# Altium project Class_D_Amp_Single_Board.PrjPcb
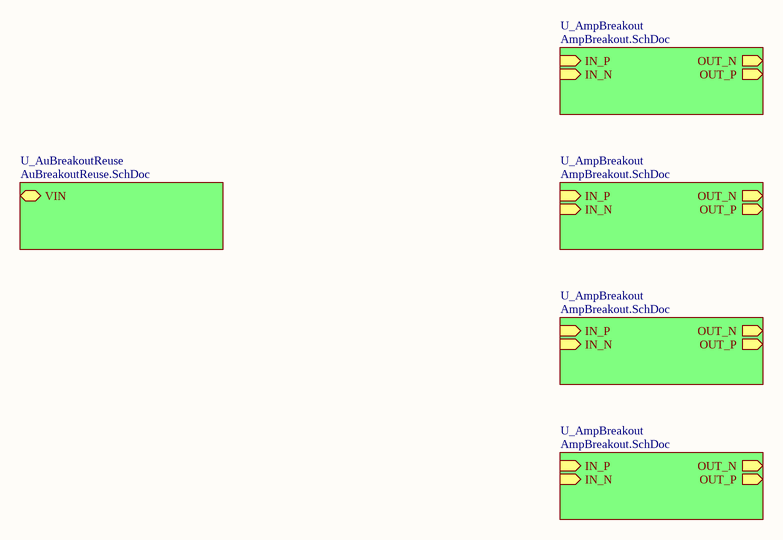
[diagram p0: TopLevelSch.SchDoc]
3 sheets, 88 parts. Net scope: hierarchical (ports join the sheet entries above them; power ports are global).
Board file: PCB1.PcbDoc
Sheets:
  TopLevelSch.SchDoc
    U_AmpBreakout = AmpBreakout.SchDoc
    U_AmpBreakout = AmpBreakout.SchDoc
    U_AmpBreakout = AmpBreakout.SchDoc
    U_AmpBreakout = AmpBreakout.SchDoc
    U_AuBreakoutReuse = AuBreakoutReuse.SchDoc

## Sheet TopLevelSch.SchDoc
size A; SheetNumber: 1; SheetTotal: 3

### Sub-sheets
U_AmpBreakout = AmpBreakout.SchDoc: OUT_N (out), OUT_P (out), IN_P (in), IN_N (in)
U_AmpBreakout = AmpBreakout.SchDoc: OUT_N (out), OUT_P (out), IN_P (in), IN_N (in)
U_AmpBreakout = AmpBreakout.SchDoc: OUT_N (out), OUT_P (out), IN_P (in), IN_N (in)
U_AmpBreakout = AmpBreakout.SchDoc: OUT_N (out), OUT_P (out), IN_P (in), IN_N (in)
U_AuBreakoutReuse = AuBreakoutReuse.SchDoc: VIN (bidir)

## Sheet AmpBreakout.SchDoc
size 431 x 279 mm; SheetNumber: 3; SheetTotal: 3
Used 4 times, as channels U_AmpBreakout, U_AmpBreakout, U_AmpBreakout, U_AmpBreakout. Parts and nets are listed once, with the designators drawn on the sheet.
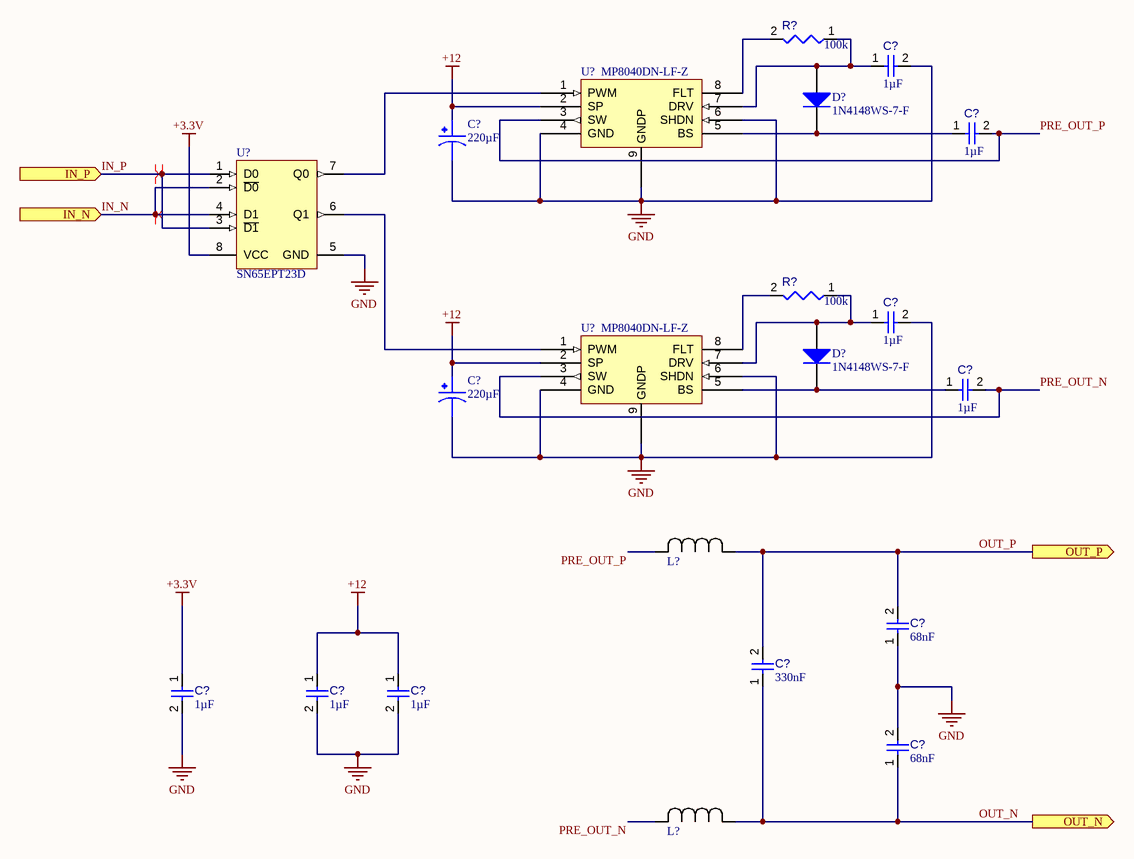
[diagram p1: AmpBreakout.SchDoc]

### Parts
(Parts that share a designator on the sheet are numbered #1, #2 ... from top to bottom, then left to right.)
C?#1  value 1µF  [CAPC2013X135X45NL10T25]  (hidden comment: Capacitor 1 uF +/- 10% 50 V 0805)
C?#2  value 1µF  [CAPC2013X135X45NL10T25]  (hidden comment: Capacitor 1 uF +/- 10% 50 V 0805)
C?#3  220µF  [CAPAE1030X1080N_UWT1H221MNL1GS]
C?#4  value 1µF  [CAPC2013X135X45NL10T25]  (hidden comment: Capacitor 1 uF +/- 10% 50 V 0805)
C?#5  value 1µF  [CAPC2013X135X45NL10T25]  (hidden comment: Capacitor 1 uF +/- 10% 50 V 0805)
C?#6  220µF  [CAPAE1030X1080N_UWT1H221MNL1GS]
C?#7  value 68nF  [FP-C0805C-DN-IPC_A]  (hidden comment: C0805C683K1RACTU)
C?#8  value 1µF  [CAPC2013X135X45NL10T25]  (hidden comment: Capacitor 1 uF +/- 10% 50 V 0805)
C?#9  value 1µF  [CAPC2013X135X45NL10T25]  (hidden comment: Capacitor 1 uF +/- 10% 50 V 0805)
C?#10  value 1µF  [CAPC2013X135X45NL10T25]  (hidden comment: Capacitor 1 uF +/- 10% 50 V 0805)
C?#11  value 330nF  [CAPC2012X14M]  (hidden comment: C2012X7R1H334K125AA)
C?#12  value 68nF  [FP-C0805C-DN-IPC_A]  (hidden comment: C0805C683K1RACTU)
D?#1  1N4148WS-7-F  [DIOD-SOD323-2-A_V]
D?#2  1N4148WS-7-F  [DIOD-SOD323-2-A_V]
L?#1  PQ2614BHA-220K  [IND_PQ2614_BRN]  (value not drawn)
L?#2  PQ2614BHA-220K  [IND_PQ2614_BRN]  (value not drawn)
R?#1  value 100k  [RESC0402(1005)_L]  (hidden comment: 100KR2F)
R?#2  value 100k  [RESC0402(1005)_L]  (hidden comment: 100KR2F)
U?#1  MP8040DN-LF-Z  [SOIC127P600X130_HS-9M]
U?#2  SN65EPT23D  [D0008A_L]
U?#3  MP8040DN-LF-Z  [SOIC127P600X130_HS-9M]

### Ports
IN_N (in), IN_P (in), OUT_N (out), OUT_P (out)

### Nets
+3.3V: C?#8.1 U?#2.8(VCC)
+12: C?#3.1 C?#6.1 C?#9.1 C?#10.1 U?#1.2(SP) U?#3.2(SP)
GND: C?#1.2 C?#3.2 C?#4.2 C?#6.2 C?#7.1 C?#8.2 C?#9.2 C?#10.2 C?#12.2 U?#1.4(GND) U?#1.6(SHDN) U?#1.9(GNDP) U?#2.5(GND) U?#3.4(GND) U?#3.6(SHDN) U?#3.9(GNDP)
IN_N: U?#2.2(~{D0}) U?#2.4(D1) ; port IN_N
IN_P: U?#2.1(D0) U?#2.3(~{D1}) ; port IN_P
OUT_N: C?#11.1 C?#12.1 L?#2.1 ; port OUT_N
OUT_P: C?#7.2 C?#11.2 L?#1.1 ; port OUT_P
PRE_OUT_N: C?#5.2 L?#2.2 U?#3.3(SW)
PRE_OUT_P: C?#2.2 L?#1.2 U?#1.3(SW)
NetC?#1_1: C?#1.1 D?#1.1(A) R?#1.1 U?#1.7(DRV)
NetC?#2_1: C?#2.1 D?#1.2(K) U?#1.5(BS)
NetC?#4_1: C?#4.1 D?#2.1(A) R?#2.1 U?#3.7(DRV)
NetC?#5_1: C?#5.1 D?#2.2(K) U?#3.5(BS)
NetR?#1_2: R?#1.2 U?#1.8(FLT)
NetR?#2_2: R?#2.2 U?#3.8(FLT)
NetU?#1_1: U?#1.1(PWM) U?#2.7(Q0)
NetU?#2_6: U?#2.6(Q1) U?#3.1(PWM)

### Channels
U_AmpBreakout: designators C?=C?_U_AmpBreakout1#11 C?=C?_U_AmpBreakout1#7 C?=C?_U_AmpBreakout1#12 C?=C?_U_AmpBreakout1#2 C?=C?_U_AmpBreakout1#1 C?=C?_U_AmpBreakout1#5 C?=C?_U_AmpBreakout1#4 C?=C?_U_AmpBreakout1#8 C?=C?_U_AmpBreakout1#9 C?=C?_U_AmpBreakout1#10 C?=C?_U_AmpBreakout1#6 C?=C?_U_AmpBreakout1#3 D?=D?_U_AmpBreakout1#1 D?=D?_U_AmpBreakout1#2 L?=L?_U_AmpBreakout1#1 L?=L?_U_AmpBreakout1#2 R?=R?_U_AmpBreakout1#1 R?=R?_U_AmpBreakout1#2 U?=U?_U_AmpBreakout1#1 U?=U?_U_AmpBreakout1#2 U?=U?_U_AmpBreakout1#3; ports IN_N=IN_N_U_AmpBreakout IN_P=IN_P_U_AmpBreakout OUT_N=OUT_N_U_AmpBreakout OUT_P=OUT_P_U_AmpBreakout
U_AmpBreakout: designators C?=C?_U_AmpBreakout2#11 C?=C?_U_AmpBreakout2#7 C?=C?_U_AmpBreakout2#12 C?=C?_U_AmpBreakout2#2 C?=C?_U_AmpBreakout2#1 C?=C?_U_AmpBreakout2#5 C?=C?_U_AmpBreakout2#4 C?=C?_U_AmpBreakout2#8 C?=C?_U_AmpBreakout2#9 C?=C?_U_AmpBreakout2#10 C?=C?_U_AmpBreakout2#6 C?=C?_U_AmpBreakout2#3 D?=D?_U_AmpBreakout2#1 D?=D?_U_AmpBreakout2#2 L?=L?_U_AmpBreakout2#1 L?=L?_U_AmpBreakout2#2 R?=R?_U_AmpBreakout2#1 R?=R?_U_AmpBreakout2#2 U?=U?_U_AmpBreakout2#1 U?=U?_U_AmpBreakout2#2 U?=U?_U_AmpBreakout2#3; ports IN_N=IN_N_U_AmpBreakout IN_P=IN_P_U_AmpBreakout OUT_N=OUT_N_U_AmpBreakout OUT_P=OUT_P_U_AmpBreakout
U_AmpBreakout: designators C?=C?_U_AmpBreakout3#11 C?=C?_U_AmpBreakout3#7 C?=C?_U_AmpBreakout3#12 C?=C?_U_AmpBreakout3#2 C?=C?_U_AmpBreakout3#1 C?=C?_U_AmpBreakout3#5 C?=C?_U_AmpBreakout3#4 C?=C?_U_AmpBreakout3#8 C?=C?_U_AmpBreakout3#9 C?=C?_U_AmpBreakout3#10 C?=C?_U_AmpBreakout3#6 C?=C?_U_AmpBreakout3#3 D?=D?_U_AmpBreakout3#1 D?=D?_U_AmpBreakout3#2 L?=L?_U_AmpBreakout3#1 L?=L?_U_AmpBreakout3#2 R?=R?_U_AmpBreakout3#1 R?=R?_U_AmpBreakout3#2 U?=U?_U_AmpBreakout3#1 U?=U?_U_AmpBreakout3#2 U?=U?_U_AmpBreakout3#3; ports IN_N=IN_N_U_AmpBreakout IN_P=IN_P_U_AmpBreakout OUT_N=OUT_N_U_AmpBreakout OUT_P=OUT_P_U_AmpBreakout
U_AmpBreakout: designators C?=C?_U_AmpBreakout4#11 C?=C?_U_AmpBreakout4#7 C?=C?_U_AmpBreakout4#12 C?=C?_U_AmpBreakout4#2 C?=C?_U_AmpBreakout4#1 C?=C?_U_AmpBreakout4#5 C?=C?_U_AmpBreakout4#4 C?=C?_U_AmpBreakout4#8 C?=C?_U_AmpBreakout4#9 C?=C?_U_AmpBreakout4#10 C?=C?_U_AmpBreakout4#6 C?=C?_U_AmpBreakout4#3 D?=D?_U_AmpBreakout4#1 D?=D?_U_AmpBreakout4#2 L?=L?_U_AmpBreakout4#1 L?=L?_U_AmpBreakout4#2 R?=R?_U_AmpBreakout4#1 R?=R?_U_AmpBreakout4#2 U?=U?_U_AmpBreakout4#1 U?=U?_U_AmpBreakout4#2 U?=U?_U_AmpBreakout4#3; ports IN_N=IN_N_U_AmpBreakout IN_P=IN_P_U_AmpBreakout OUT_N=OUT_N_U_AmpBreakout OUT_P=OUT_P_U_AmpBreakout

### Layout directives
differential pair: IN_N_U_AmpBreakout, IN_P_U_AmpBreakout

### Notes on the sheet
- DWG. NO.
- REV.
- SHT.
- THIS DOCUMENT AND THE DATA DISCLOSED HEREIN OR HEREWITH IS THE PROPERTY OF ALTIUM LIMITED AND MAY BE FREELY DISTRIBUTED IN WHOLE. NO RIGHTS ARE RESERVED OR EXPRESS OR IMPLIED WARANTEE GIVEN.
- REVISION
- DESCRIPTION
- DATE
- APPROVED
- ENG:
- APPROVALS
- PROJECT
- DSN:
- CHK:
- REFERENCE DOCUMENTS
- PROJECT REVISION:
- TITLE
- DOCUMENT REVISION:
- DESIGN ITEM:
- BOM:
- FAB DWG:
- PCB DWG:
- ASSY DWG:
- SCALE:
- SIZE
- B
- CAGE CODE
- FILE NAME
- DWG NO.
- SHEET
- OF
- REV

### Library data of the parts
C?#1 C?#2 C?#4 C?#5 C?#8-C?#10 = CMP-001-00007-6: Chip Capacitor, 1 uF, +/- 10%, 50 V, 0805 (2012 Metric); Capacitor Type: Ceramic; Voltage Rating: 50V; Min Operating Temperature: -55°C; RoHS Compliant: True; Mounting Technology: SM; Case/Package: 0805; Max Operating Temperature: 125°C; Tolerance: 10%; Pins: 2
C?#3 C?#6 = CMP-017-000000-1: 220ÂµF 50V Aluminum Electrolytic Capacitors Radial, Can - SMD 1000 Hrs @ 105Â°C; MF: Nichicon; SnapEDA_Link: https://www.snapeda.com/parts/UWT1H221MNL1GS/Nichicon/view-part/566503/?ref=snap; Package: Radial Nichicon; Source: SnapEDAsch.SchLib; Price: None; Pin Count: 2; Value: *; Availability: Unavailable; MP: UWT1H221MNL1GS; Component Type: Standard; Design Item ID: UWT1H221MNL1GS
C?#7 C?#12 = CMP-001-00086-1: Ceramic Capacitor, Multilayer, Ceramic, 100V, 10% +Tol, 10% -Tol, X7R, 15% TC, 0.068uF, Surface Mount, 0805; Min Operating Temperature: -55°C; Mounting Technology: Surface Mount; Max Operating Temperature: 125°C; RoHS Compliant: Yes; Pins: 2; Capacitor Type: Ceramic; Case/Package: 0805
C?#11 = CMP-001-00084-2: Ceramic Capacitor, Multilayer, Ceramic, 50V, 10% +Tol, 10% -Tol, X7R, 15% TC, 0.33uF, Surface Mount, 0805; Pins: 2; RoHS Compliant: Yes; Min Operating Temperature: -55°C; Capacitor Type: Ceramic; Max Operating Temperature: 125°C; Case/Package: 0805; Mounting Technology: Surface Mount
D?#1 D?#2 = CMP-004-00002-2: Fast Switching Diode, 75 V, 0.3 A, -65 to 150 degC, 2-Pin SOD323, RoHS, Tape and Reel; Manufacturer: Diodes Inc; Peak Reverse Current: 1uA; Max Surge Current: 2A; Elements: 1; Forward Current: 300mA; Recovery Time: 4ns; Forward Voltage: 1.25V; Datasheet Version: Rev. 25-2, 03/2016; Case/Package: SOD; Min Operating Temperature: -65°C; RoHS Compliant: True; Max Operating Temperature: 150°C; Manufacturer URL: http://www.diodes.com/; Pins: 2; Package Quantity: 3000; Datasheet URL: http://www.diodes.com/datasheets/ds30097.pdf; Packaging: TapeandReel; Package Description: 2-Pin Small Outline Diode, Body 1.7 x 1.3 mm; Mounting Technology: SM; Package Reference: SOD323-2
L?#1 L?#2 = CMP-006-00021-1: No Description Available; Mfr_Name: Bourns Electronics; Type: Fixed Inductors; Design Item ID: PQ2614BHA-220K; Source: PQ2614BHA-220K.SchLib
R?#1 R?#2 = CMP-009-00064-2: 100K 0.063W 1% 0402 (1005 Metric)  SMD; Power: 63mW; Case/Package: 0402; Mounting Technology: SMT; Pins: 2; Tolerance: 1%
U?#1 U?#3 = CMP-00024-00006-1: Half Bridge Based Peripheral Driver, 9A, PDSO8; Nominal Supply Voltage: 12V; Built-in Protections: Over Current,Under Voltage,THERMAL; Case/Package: HLSOP; Pins: 8; Interface IC Type: HALF BRIDGE BASED PERIPHERAL DRIVER; Max Operating Temperature: 85°C; RoHS Compliant: Yes; JESD-30 Code: R-PDSO-G8; Min Operating Temperature: -40°C; Height - Seated (Max): 1.676mm
U?#2 = CMP-016-00010-1: Low Skew Clock Driver, 65EP Series, 2 True Output(s), 0 Inverted Output(s), ECL, PDSO8; Nominal Supply Voltage: 3.3V; Min Supply Voltage: 3V; Max Supply Voltage: 3.6V; Input Conditioning: DIFFERENTIAL; RoHS Compliant: Yes; Height - Seated (Max): 1.75mm; Logic Type: LOW SKEW CLOCK DRIVER; Max Operating Temperature: 85°C; JESD-30 Code: R-PDSO-G8; Min Operating Temperature: -40°C; Case/Package: SOP; JESD-609 Code: e4; Pins: 8

## Sheet AuBreakoutReuse.SchDoc
size 863 x 558 mm; SheetNumber: 2; SheetTotal: 2
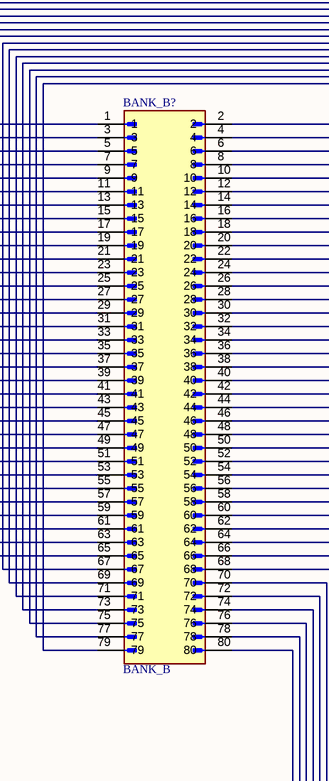
[diagram p2: AuBreakoutReuse.SchDoc, left]
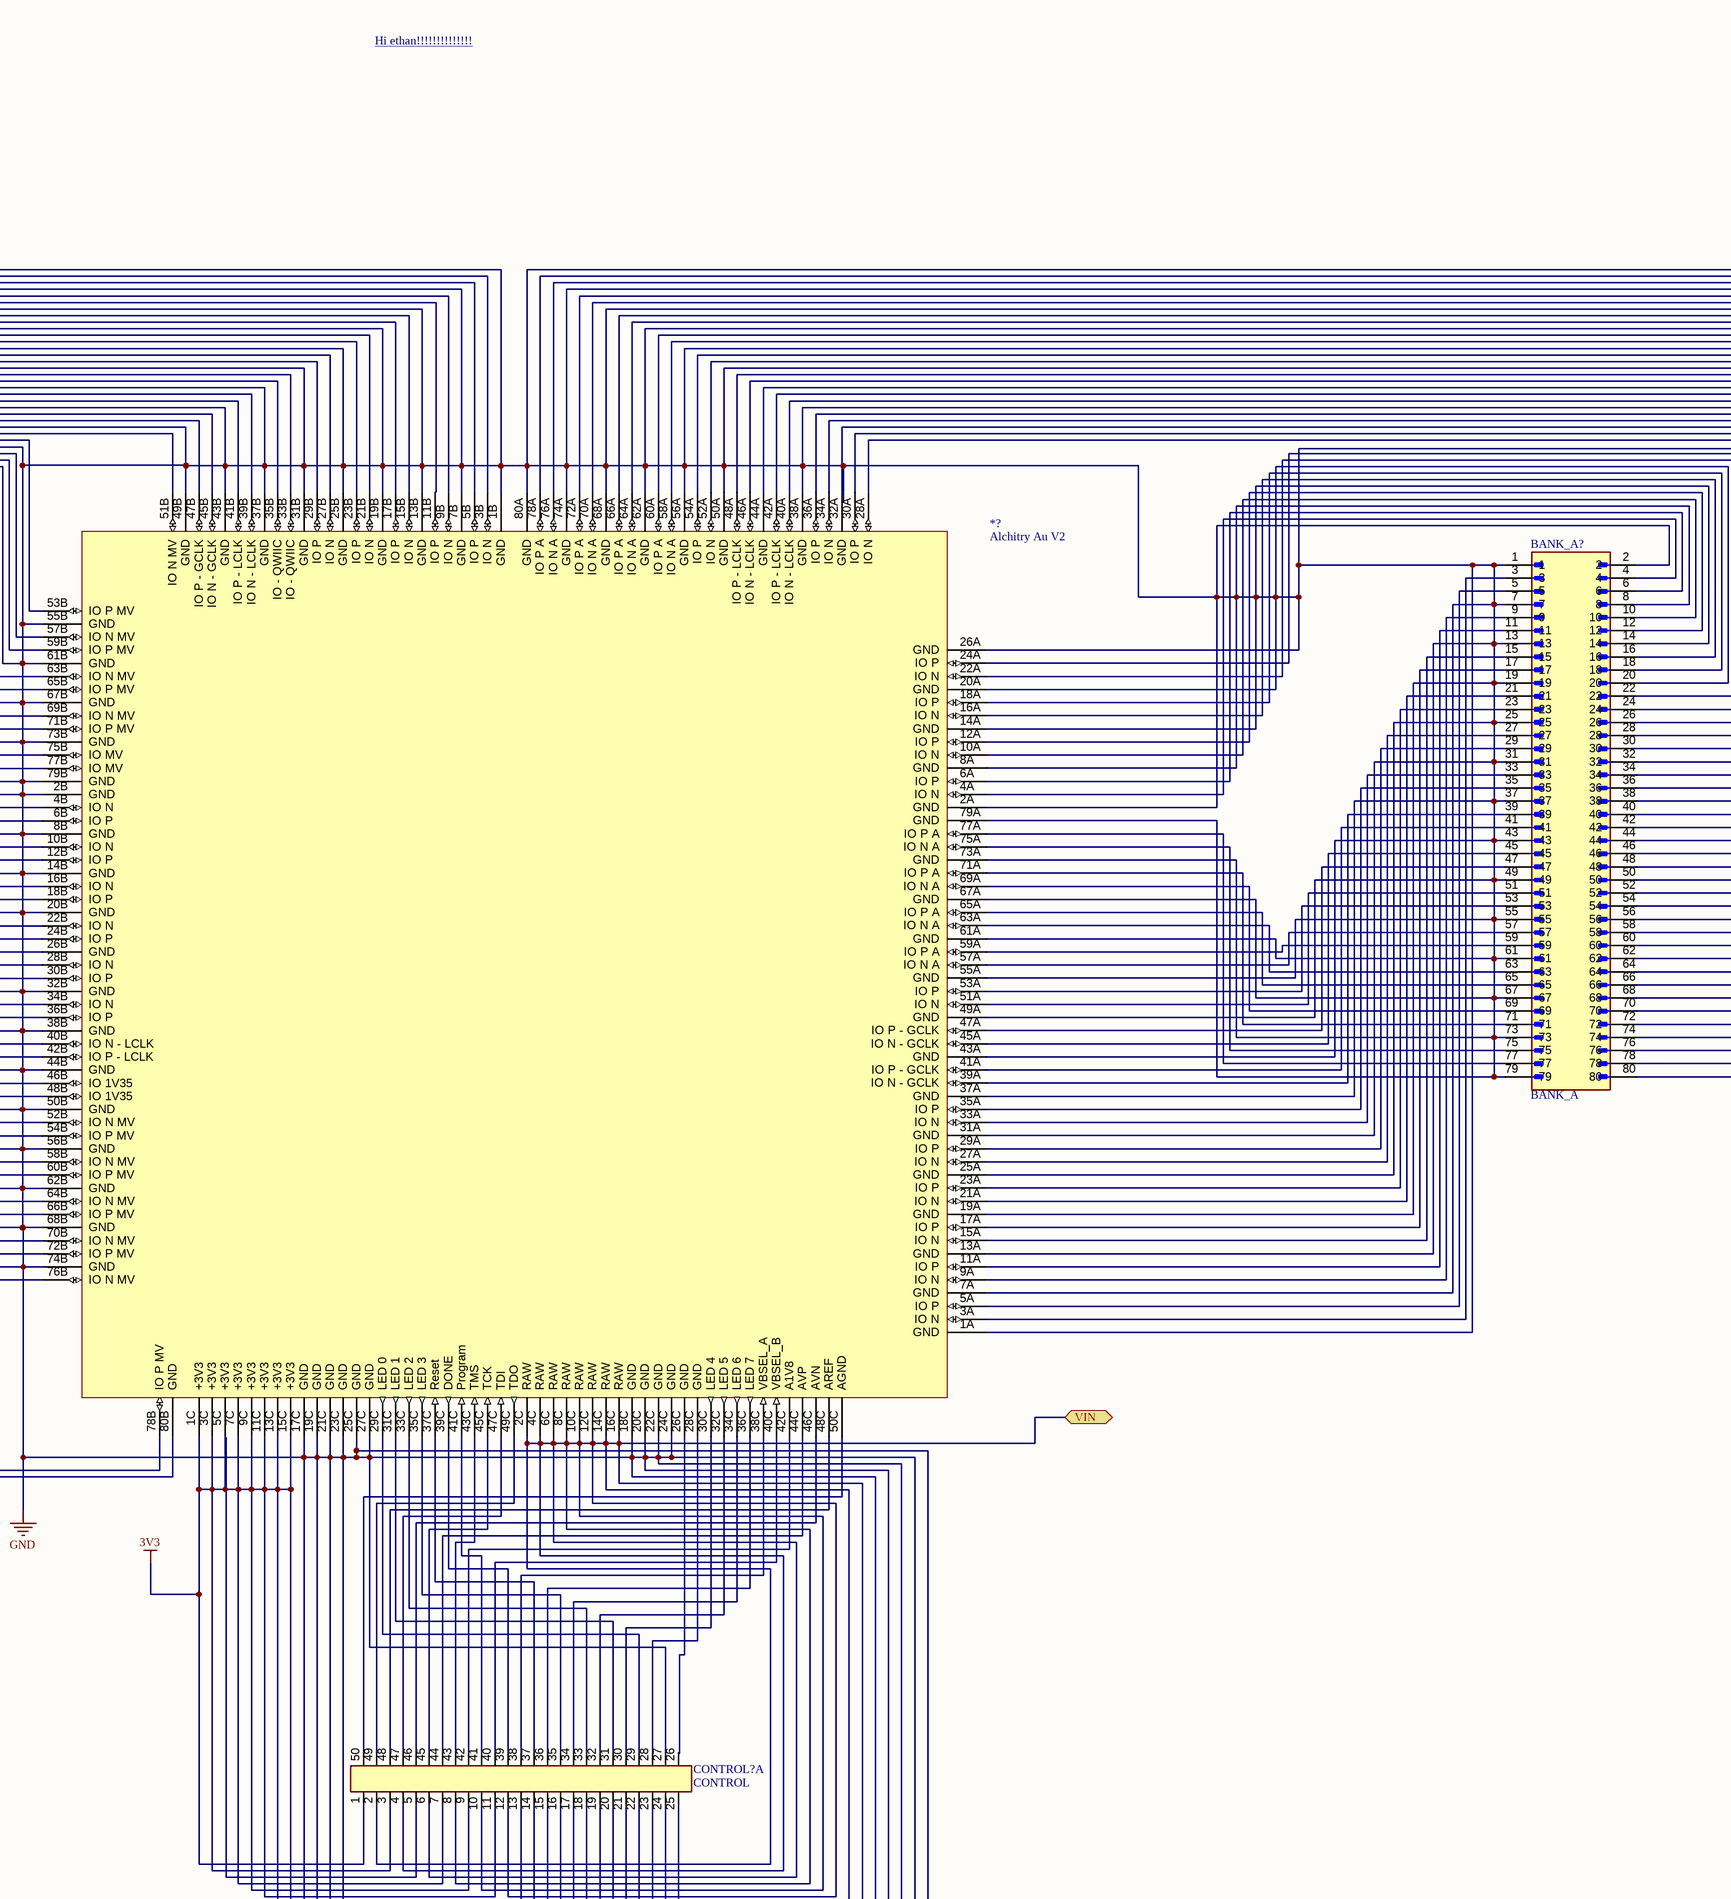
[diagram p3: AuBreakoutReuse.SchDoc, right]

### Parts
*?  Alchitry Au V2
BANK_A?  BANK_A  [HRS_DF40C-80DP-0.4V(51)]
BANK_B?  BANK_B  [HRS_DF40C-80DP-0.4V(51)]
CONTROL?  CONTROL  [DF40C-50DP-0.4V(51)]  (part A of 2)

### Ports
VIN (bidir)

### Nets
3V3: *?.1C(+3V3) *?.3C(+3V3) *?.5C(+3V3) *?.7C(+3V3) *?.9C(+3V3) *?.11C(+3V3) *?.13C(+3V3) *?.15C(+3V3) CONTROL?.1(P$1) CONTROL?.3(P$3) CONTROL?.7(P$7) CONTROL?.9(P$9) CONTROL?.11(P$11) CONTROL?.13(P$13) CONTROL?.15(P$15)
GND: *?.1A(GND) *?.1B(GND) *?.2A(GND) *?.2B(GND) *?.7A(GND) *?.7B(GND) *?.8A(GND) *?.8B(GND) *?.13A(GND) *?.13B(GND) *?.14A(GND) *?.14B(GND) *?.17C(GND) *?.18C(GND) *?.19A(GND) *?.19B(GND) *?.19C(GND) *?.20A(GND) *?.20B(GND) *?.20C(GND) *?.21C(GND) *?.22C(GND) *?.23C(GND) *?.24C(GND) *?.25A(GND) *?.25B(GND) *?.25C(GND) *?.26A(GND) *?.27C(GND) *?.31A(GND) *?.31B(GND) *?.32B(GND) *?.37A(GND) *?.37B(GND) *?.38A(GND) *?.38B(GND) *?.43A(GND) *?.43B(GND) *?.44B(GND) *?.49A(GND) *?.49B(GND) *?.50A(GND) *?.50B(GND) *?.55A(GND) *?.55B(GND) *?.56A(GND) *?.56B(GND) *?.61A(GND) *?.61B(GND) *?.62A(GND) *?.62B(GND) *?.67A(GND) *?.67B(GND) *?.68A(GND) *?.68B(GND) *?.73A(GND) *?.73B(GND) *?.74A(GND) *?.74B(GND) *?.79A(GND) *?.79B(GND) *?.80A(GND) BANK_A?.1 BANK_A?.2 BANK_A?.7 BANK_A?.8 BANK_A?.13 BANK_A?.14 BANK_A?.19 BANK_A?.20 BANK_A?.25 BANK_A?.26 BANK_A?.31 BANK_A?.37 BANK_A?.38 BANK_A?.43 BANK_A?.49 BANK_A?.50 BANK_A?.55 BANK_A?.56 BANK_A?.61 BANK_A?.62 BANK_A?.67 BANK_A?.68 BANK_A?.73 BANK_A?.74 BANK_A?.79 BANK_A?.80 BANK_B?.1 BANK_B?.2 BANK_B?.7 BANK_B?.8 BANK_B?.13 BANK_B?.14 BANK_B?.19 BANK_B?.20 BANK_B?.25 BANK_B?.31 BANK_B?.32 BANK_B?.37 BANK_B?.38 BANK_B?.43 BANK_B?.44 BANK_B?.49 BANK_B?.50 BANK_B?.55 BANK_B?.56 BANK_B?.61 BANK_B?.62 BANK_B?.67 BANK_B?.68 BANK_B?.73 BANK_B?.74 BANK_B?.79 CONTROL?.17(P$17) CONTROL?.18(P$18) CONTROL?.19(P$19) CONTROL?.20(P$20) CONTROL?.21(P$21) CONTROL?.22(P$22) CONTROL?.23(P$23) CONTROL?.24(P$24) CONTROL?.25(P$25) CONTROL?.27(P$27)
Net*?_2C: *?.2C(RAW) *?.4C(RAW) *?.6C(RAW) *?.8C(RAW) *?.10C(RAW) *?.12C(RAW) *?.14C(RAW) *?.16C(RAW) CONTROL?.2(P$2) CONTROL?.4(P$4) CONTROL?.6(P$6) CONTROL?.8(P$8) CONTROL?.10(P$10) CONTROL?.12(P$12) CONTROL?.14(P$14) CONTROL?.16(P$16) ; port VIN
Net*?_3A: *?.3A(IO_N) BANK_A?.3
Net*?_3B: *?.3B(IO_N) BANK_B?.3
Net*?_4A: *?.4A(IO_N) BANK_A?.4
Net*?_4B: *?.4B(IO_N) BANK_B?.4
Net*?_5A: *?.5A(IO_P) BANK_A?.5
Net*?_5B: *?.5B(IO_P) BANK_B?.5
Net*?_6A: *?.6A(IO_P) BANK_A?.6
Net*?_6B: *?.6B(IO_P) BANK_B?.6
Net*?_9A: *?.9A(IO_N) BANK_A?.9
Net*?_9B: *?.9B(IO_N) BANK_B?.9
Net*?_10A: *?.10A(IO_N) BANK_A?.10
Net*?_10B: *?.10B(IO_N) BANK_B?.10
Net*?_11A: *?.11A(IO_P) BANK_A?.11
Net*?_11B: *?.11B(IO_P) BANK_B?.11
Net*?_12A: *?.12A(IO_P) BANK_A?.12
Net*?_12B: *?.12B(IO_P) BANK_B?.12
Net*?_15A: *?.15A(IO_N) BANK_A?.15
Net*?_15B: *?.15B(IO_N) BANK_B?.15
Net*?_16A: *?.16A(IO_N) BANK_A?.16
Net*?_16B: *?.16B(IO_N) BANK_B?.16
Net*?_17A: *?.17A(IO_P) BANK_A?.17
Net*?_17B: *?.17B(IO_P) BANK_B?.17
Net*?_18A: *?.18A(IO_P) BANK_A?.18
Net*?_18B: *?.18B(IO_P) BANK_B?.18
Net*?_21A: *?.21A(IO_N) BANK_A?.21
Net*?_21B: *?.21B(IO_N) BANK_B?.21
Net*?_22A: *?.22A(IO_N) BANK_A?.22
Net*?_22B: *?.22B(IO_N) BANK_B?.22
Net*?_23A: *?.23A(IO_P) BANK_A?.23
Net*?_23B: *?.23B(IO_P) BANK_B?.23
Net*?_24A: *?.24A(IO_P) BANK_A?.24
Net*?_24B: *?.24B(IO_P) BANK_B?.24
Net*?_26B: *?.26B(GND) BANK_B?.26
Net*?_26C: *?.26C(GND) CONTROL?.26(P$26)
Net*?_27A: *?.27A(IO_N) BANK_A?.27
Net*?_27B: *?.27B(IO_N) BANK_B?.27
Net*?_28A: *?.28A(IO_N) BANK_A?.28
Net*?_28B: *?.28B(IO_N) BANK_B?.28
Net*?_28C: *?.28C(GND) CONTROL?.28(P$28)
Net*?_29A: *?.29A(IO_P) BANK_A?.29
Net*?_29B: *?.29B(IO_P) BANK_B?.29
Net*?_29C: *?.29C(LED_0) CONTROL?.29(P$29)
Net*?_30A: *?.30A(IO_P) BANK_A?.30
Net*?_30B: *?.30B(IO_P) BANK_B?.30
Net*?_30C: *?.30C(LED_4) CONTROL?.30(P$30)
Net*?_31C: *?.31C(LED_1) CONTROL?.31(P$31)
Net*?_32A: *?.32A(GND) BANK_A?.32
Net*?_32C: *?.32C(LED_5) CONTROL?.32(P$32)
Net*?_33A: *?.33A(IO_N) BANK_A?.33
Net*?_33B: *?.33B(IO_-_QWIIC) BANK_B?.33
Net*?_33C: *?.33C(LED_2) CONTROL?.33(P$33)
Net*?_34A: *?.34A(IO_N) BANK_A?.34
Net*?_34B: *?.34B(IO_N) BANK_B?.34
Net*?_34C: *?.34C(LED_6) CONTROL?.34(P$34)
Net*?_35A: *?.35A(IO_P) BANK_A?.35
Net*?_35B: *?.35B(IO_-_QWIIC) BANK_B?.35
Net*?_35C: *?.35C(LED_3) CONTROL?.35(P$35)
Net*?_36A: *?.36A(IO_P) BANK_A?.36
Net*?_36B: *?.36B(IO_P) BANK_B?.36
Net*?_36C: *?.36C(LED_7) CONTROL?.36(P$36)
Net*?_37C: *?.37C(Reset) CONTROL?.37(P$37)
Net*?_38C: *?.38C(VBSEL_A) CONTROL?.38(P$38)
Net*?_39A: *?.39A(IO_N_-_GCLK) BANK_A?.39
Net*?_39B: *?.39B(IO_N_-_LCLK) BANK_B?.39
Net*?_39C: *?.39C(DONE) CONTROL?.39(P$39)
Net*?_40A: *?.40A(IO_N_-_LCLK) BANK_A?.40
Net*?_40B: *?.40B(IO_N_-_LCLK) BANK_B?.40
Net*?_40C: *?.40C(VBSEL_B) CONTROL?.40(P$40)
Net*?_41A: *?.41A(IO_P_-_GCLK) BANK_A?.41
Net*?_41B: *?.41B(IO_P_-_LCLK) BANK_B?.41
Net*?_41C: *?.41C(Program) CONTROL?.41(P$41)
Net*?_42A: *?.42A(IO_P_-_LCLK) BANK_A?.42
Net*?_42B: *?.42B(IO_P_-_LCLK) BANK_B?.42
Net*?_42C: *?.42C(A1V8) CONTROL?.42(P$42)
Net*?_43C: *?.43C(TMS) CONTROL?.43(P$43)
Net*?_44A: *?.44A(GND) BANK_A?.44
Net*?_44C: *?.44C(AVP) CONTROL?.44(P$44)
Net*?_45A: *?.45A(IO_N_-_GCLK) BANK_A?.45
Net*?_45B: *?.45B(IO_N_-_GCLK) BANK_B?.45
Net*?_45C: *?.45C(TCK) CONTROL?.45(P$45)
Net*?_46A: *?.46A(IO_N_-_LCLK) BANK_A?.46
Net*?_46B: *?.46B(IO_1V35) BANK_B?.46
Net*?_46C: *?.46C(AVN) CONTROL?.46(P$46)
Net*?_47A: *?.47A(IO_P_-_GCLK) BANK_A?.47
Net*?_47B: *?.47B(IO_P_-_GCLK) BANK_B?.47
Net*?_47C: *?.47C(TDI) CONTROL?.47(P$47)
Net*?_48A: *?.48A(IO_P_-_LCLK) BANK_A?.48
Net*?_48B: *?.48B(IO_1V35) BANK_B?.48
Net*?_48C: *?.48C(AREF) CONTROL?.48(P$48)
Net*?_49C: *?.49C(TDO) CONTROL?.49(P$49)
Net*?_50C: *?.50C(AGND) CONTROL?.50(P$50)
Net*?_51A: *?.51A(IO_N) BANK_A?.51
Net*?_51B: *?.51B(IO_N_MV) BANK_B?.51
Net*?_52A: *?.52A(IO_N) BANK_A?.52
Net*?_52B: *?.52B(IO_N_MV) BANK_B?.52
Net*?_53A: *?.53A(IO_P) BANK_A?.53
Net*?_53B: *?.53B(IO_P_MV) BANK_B?.53
Net*?_54A: *?.54A(IO_P) BANK_A?.54
Net*?_54B: *?.54B(IO_P_MV) BANK_B?.54
Net*?_57A: *?.57A(IO_N_A) BANK_A?.57
Net*?_57B: *?.57B(IO_N_MV) BANK_B?.57
Net*?_58A: *?.58A(IO_N_A) BANK_A?.58
Net*?_58B: *?.58B(IO_N_MV) BANK_B?.58
Net*?_59A: *?.59A(IO_P_A) BANK_A?.59
Net*?_59B: *?.59B(IO_P_MV) BANK_B?.59
Net*?_60A: *?.60A(IO_P_A) BANK_A?.60
Net*?_60B: *?.60B(IO_P_MV) BANK_B?.60
Net*?_63A: *?.63A(IO_N_A) BANK_A?.63
Net*?_63B: *?.63B(IO_N_MV) BANK_B?.63
Net*?_64A: *?.64A(IO_N_A) BANK_A?.64
Net*?_64B: *?.64B(IO_N_MV) BANK_B?.64
Net*?_65A: *?.65A(IO_P_A) BANK_A?.65
Net*?_65B: *?.65B(IO_P_MV) BANK_B?.65
Net*?_66A: *?.66A(IO_P_A) BANK_A?.66
Net*?_66B: *?.66B(IO_P_MV) BANK_B?.66
Net*?_69A: *?.69A(IO_N_A) BANK_A?.69
Net*?_69B: *?.69B(IO_N_MV) BANK_B?.69
Net*?_70A: *?.70A(IO_N_A) BANK_A?.70
Net*?_70B: *?.70B(IO_N_MV) BANK_B?.70
Net*?_71A: *?.71A(IO_P_A) BANK_A?.71
Net*?_71B: *?.71B(IO_P_MV) BANK_B?.71
Net*?_72A: *?.72A(IO_P_A) BANK_A?.72
Net*?_72B: *?.72B(IO_P_MV) BANK_B?.72
Net*?_75A: *?.75A(IO_N_A) BANK_A?.75
Net*?_75B: *?.75B(IO_MV) BANK_B?.75
Net*?_76A: *?.76A(IO_N_A) BANK_A?.76
Net*?_76B: *?.76B(IO_N_MV) BANK_B?.76
Net*?_77A: *?.77A(IO_P_A) BANK_A?.77
Net*?_77B: *?.77B(IO_MV) BANK_B?.77
Net*?_78A: *?.78A(IO_P_A) BANK_A?.78
Net*?_78B: *?.78B(IO_P_MV) BANK_B?.78
Net*?_80B: *?.80B(GND) BANK_B?.80

Not connected (* = marked no-connect by the designer): CONTROL? 5(P$5)

### Notes on the sheet
- Hi ethan!!!!!!!!!!!!!! <creations.mtdv.me>
- DWG. NO.
- REV.
- SHT.
- REVISION
- DESCRIPTION
- DATE
- APPROVED
- THIS DOCUMENT AND THE DATA DISCLOSED HEREIN OR HEREWITH IS THE PROPERTY OF ALTIUM LIMITED AND MAY BE FREELY DISTRIBUTED IN WHOLE. NO RIGHTS ARE RESERVED OR EXPRESS OR IMPLIED WARANTEE GIVEN.
- ENG:
- DSN:
- APPROVALS
- PROJECT
- DOCUMENT REVISION:
- DESIGN ITEM:
- CHK:
- BOM:
- REFERENCE DOCUMENTS
- PROJECT REVISION:
- TITLE
- FAB DWG:
- PCB DWG:
- ASSY DWG:
- SCALE:
- SIZE
- D
- CAGE CODE
- FILE NAME
- DWG NO.
- SHEET
- OF
- REV

### Library data of the parts
*? = CMP-031-00006-1
BANK_A? BANK_B? = CMP-002-00074-1: 80 Position Connector Plug, Outer Shroud Contacts Surface Mount Gold; MF: Hirose Electric; Value: *; SnapEDA_Link: https://www.snapeda.com/parts/DF40C-80DP-0.4V(51)/Hirose/view-part/?ref=snap; Design Item ID: DF40C-80DP-0.4V(51); Case/Package: None; Check_prices: https://www.snapeda.com/parts/DF40C-80DP-0.4V(51)/Hirose/view-part/?ref=eda; MP: DF40C-80DP-0.4V(51); Source: DF40C-80DP-0.4V(51).SchLib; Component Type: Standard; Pins: 80
CONTROL? = CMP-002-00073-1: 50 Position Connector Plug, Outer Shroud Contacts Surface Mount Gold; MF: Hirose Electric Co Ltd; Source: DF40C-50DP-0.4V(51).SchLib; MP: DF40C-50DP-0.4V(51); SnapEDA_Link: https://www.snapeda.com/parts/DF40C-50DP-0.4V(51)/Hirose/view-part/?ref=snap; Check_prices: https://www.snapeda.com/parts/DF40C-50DP-0.4V(51)/Hirose/view-part/?ref=eda; Design Item ID: DF40C-50DP-0.4V(51); Case/Package: None; Value: *; Component Type: Standard; Pins: 54

## Nets that join several sheets
+3.3V: U_AmpBreakout (C?_U_AmpBreakout1#8.1 U?_U_AmpBreakout1#2.8), U_AmpBreakout (C?_U_AmpBreakout2#8.1 U?_U_AmpBreakout2#2.8), U_AmpBreakout (C?_U_AmpBreakout3#8.1 U?_U_AmpBreakout3#2.8), U_AmpBreakout (C?_U_AmpBreakout4#8.1 U?_U_AmpBreakout4#2.8)
+12: U_AmpBreakout (6 pins), U_AmpBreakout (6 pins), U_AmpBreakout (6 pins), U_AmpBreakout (6 pins)
GND: U_AmpBreakout (16 pins), U_AmpBreakout (16 pins), U_AmpBreakout (16 pins), U_AmpBreakout (16 pins), AuBreakoutReuse (124 pins)